# EAGLE design buttons (EAGLE 5.10)
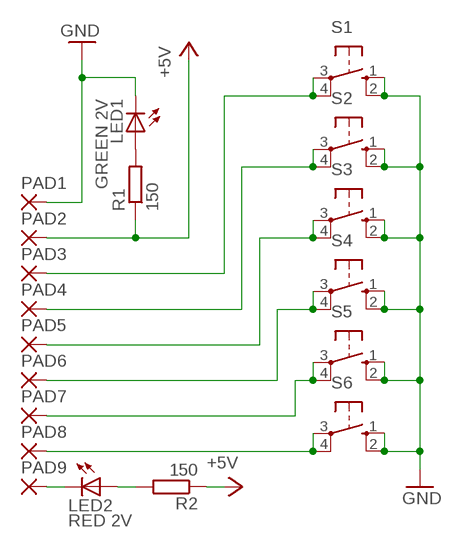
[diagram p0: schematic, sheet 1]

## Parts
LED1  GREEN 2V  LED5MM  [LED5MM]
LED2  RED 2V  LED5MM  [LED5MM]
PAD1  2,54/0,8  [2,54/0,8]
PAD2  2,54/0,8  [2,54/0,8]
PAD3  2,54/0,8  [2,54/0,8]
PAD4  2,54/0,8  [2,54/0,8]
PAD5  2,54/0,8  [2,54/0,8]
PAD6  2,54/0,8  [2,54/0,8]
PAD7  2,54/0,8  [2,54/0,8]
PAD8  2,54/0,8  [2,54/0,8]
PAD9  2,54/0,8  [2,54/0,8]
R1  150  R-EU_0204/7  [0204/7]
R2  150  R-EU_0204/7  [0204/7]
S1  10-XX  [B3F-10XX]
S2  10-XX  [B3F-10XX]
S3  10-XX  [B3F-10XX]
S4  10-XX  [B3F-10XX]
S5  10-XX  [B3F-10XX]
S6  10-XX  [B3F-10XX]

## Nets
+5V: PAD2.1(P) R1.1 R2.1
GND: LED1.K(C) PAD1.1(P) S1.1(S) S1.2(S1) S2.1(S) S2.2(S1) S3.1(S) S3.2(S1) S4.1(S) S4.2(S1) S5.1(S) S5.2(S1) S6.1(S) S6.2(S1)
N$1: LED1.A R1.2
N$2: LED2.K(C) PAD9.1(P)
N$3: LED2.A R2.2
N$4: PAD8.1(P) S6.3(P) S6.4(P1)
N$5: PAD7.1(P) S5.3(P) S5.4(P1)
N$6: PAD6.1(P) S4.3(P) S4.4(P1)
N$7: PAD5.1(P) S3.3(P) S3.4(P1)
N$8: PAD4.1(P) S2.3(P) S2.4(P1)
N$9: PAD3.1(P) S1.3(P) S1.4(P1)

## Library data of the parts
LED1 LED2 = led:LED: LED OSRAM: - CHIPLED LG R971, LG N971, LY N971, LG Q971, LY Q971, LO R971, LY R971 LH N974, LH R974 LS Q976, LO Q976, LY Q976 LO Q996 - Hyper CHIPLED LW Q18S LB Q993, LB Q99A, LB R99A - SideLED LS A670, LO A670, LY A670, LG A670, LP A670 LB A673, LV A673, LT A673, LW A673 LH A674 LY A675 LS A676, LA A676, LO A676, LY A676, LW A676 LS A679, LY A679, LG A679 - Hyper Micro SIDELED® LS Y876, LA Y876, LO Y876, LY Y876 LT Y87S - SmartLED LW L88C, LW L88S LB L89C, LB L89S, LG L890 LS L89K, LO L89K, LY L89K LS L896, LA L896, LO L896, LY L896 - TOPLED LS T670, LO T670, LY T670, LG T670, LP T670 LSG T670, LSP T670, LSY T670, LOP T670, LYG T670 LG T671, LOG T671, LSG T671 LB T673, LV T673, LT T673, LW T673 LH T674 LS T676, LA T676, LO T676, LY T676, LB T676, LH T676, LSB T676, LW T676 LB T67C, LV T67C, LT T67C, LS T67K, LO T67K, LY T67K, LW E67C LS E67B, LA E67B, LO E67B, LY E67B, LB E67C, LV E67C, LT E67C LW T67C LS T679, LY T679, LG T679 LS T770, LO T770, LY T770, LG T770, LP T770 LB T773, LV T773, LT T773, LW T773 LH T774 LS E675, LA E675, LY E675, LS T675 LS T776, LA T776, LO T776, LY T776, LB T776 LHGB T686 LT T68C, LB T68C - Hyper Mini TOPLED® LB M676 - Mini TOPLED Santana® LG M470 LS M47K, LO M47K, LY M47K Source: http://www.osram.convergy.de LUXEON: - LUMILED® LXK2-PW12-R00, LXK2-PW12-S00, LXK2-PW14-U00, LXK2-PW14-V00 LXK2-PM12-R00, LXK2-PM12-S00, LXK2-PM14-U00 LXK2-PE12-Q00, LXK2-PE12-R00, LXK2-PE12-S00, LXK2-PE14-T00, LXK2-PE14-U00 LXK2-PB12-K00, LXK2-PB12-L00, LXK2-PB12-M00, LXK2-PB14-N00, LXK2-PB14-P00, LXK2-PB14-Q00 LXK2-PR12-L00, LXK2-PR12-M00, LXK2-PR14-Q00, LXK2-PR14-R00 LXK2-PD12-Q00, LXK2-PD12-R00, LXK2-PD12-S00 LXK2-PH12-R00, LXK2-PH12-S00 LXK2-PL12-P00, LXK2-PL12-Q00, LXK2-PL12-R00 Source: www.luxeon.com KINGBRIGHT: KA-3528ASYC Source: www.kingbright.com
PAD1-PAD9 = wirepad:2,54/0,8: THROUGH-HOLE PAD
R1 R2 = rcl:R-EU_: RESISTOR, European symbol
S1-S6 = switch-omron:10-XX: OMRON SWITCH

## Board
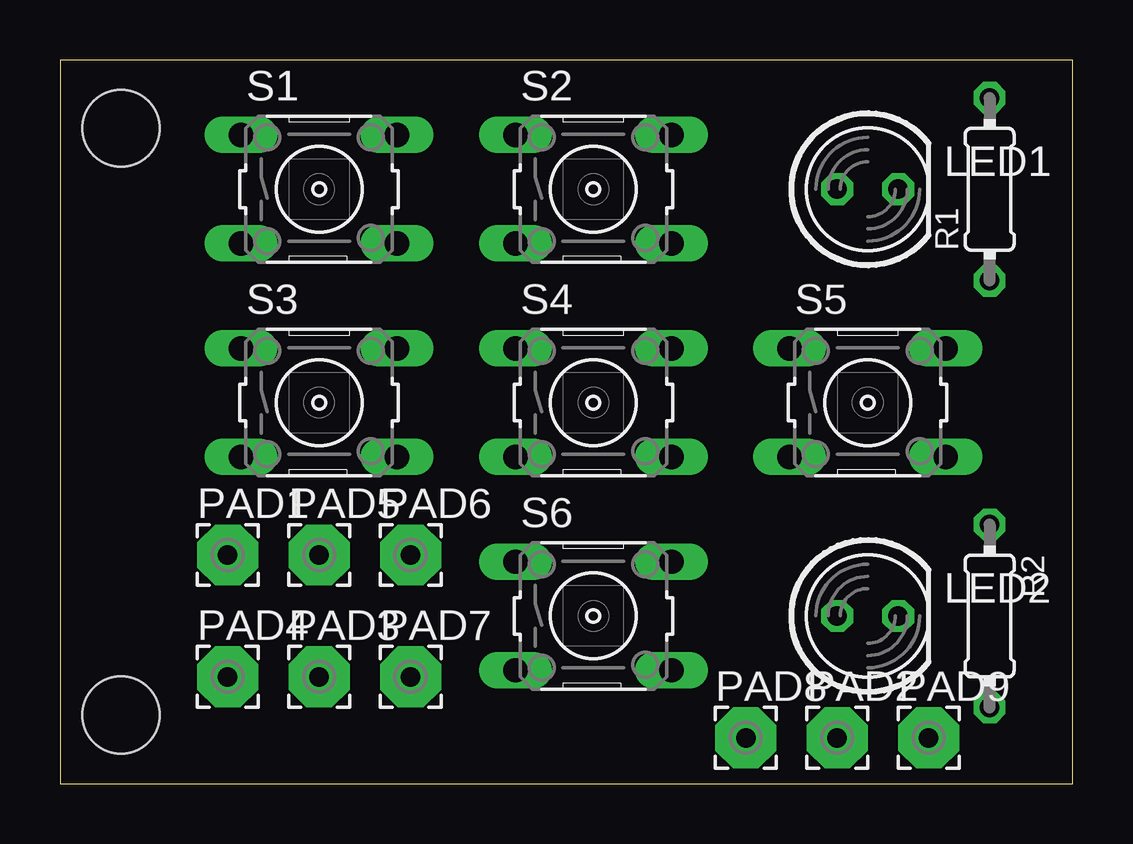
[diagram p1: board, top side]
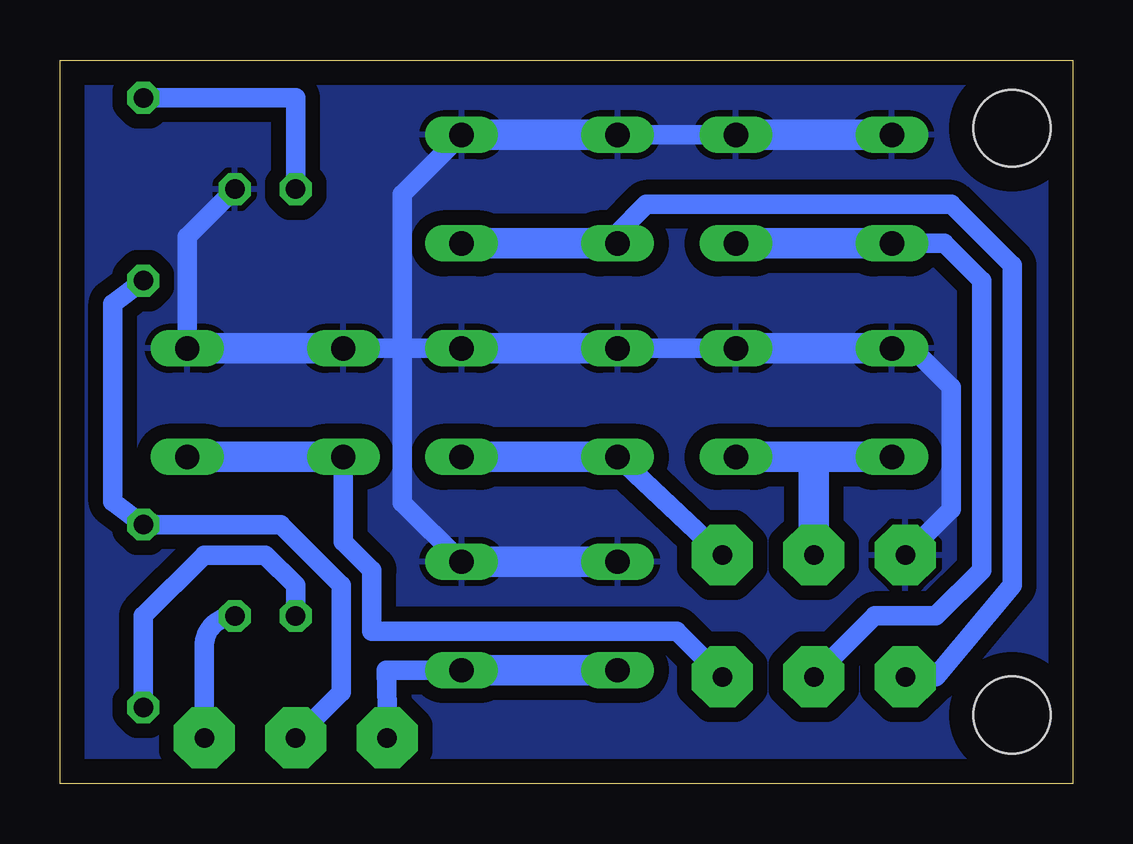
[diagram p2: board, bottom side, seen from below]

Size 42.21 x 30.15 mm. Coordinates in mm from the lower left corner, seen from the top.
Outline: 0,0 42.21,0 42.21,30.15 0,30.15 0,0
Copper layers (1*16): Top 0.035mm / dielectric 1.5mm / Bottom 0.035mm
Design rules "default": minimum track width 10mil, minimum drill 24mil, track to track 8mil, track to pad 8mil, pad to pad 8mil, via to via 8mil, smd to smd 8mil, copper to edge 40mil, drill to drill 8mil, minimum pad ring 10mil, minimum via ring 8mil, stop-mask expansion 4mil, vias tented up to drill 0mil, thermal gap 10mil
Holes 3.2 mm at 2.54,27.3 2.54,2.86

### Footprints (pad centres in the part's own frame; a part is rotated, then mirrored left to right if it is on the bottom)
LED5MM = drill 0.813 octagon: A -1.27,0; K 1.27,0
2,54/0,8 = drill 0.813 pad 2.54 octagon: 1 0,0
0204/7 = drill 0.813 octagon: 1 -3.81,0; 2 3.81,0
B3F-10XX = drill 1.016 long: 1 -3.251,2.261; 2 3.251,2.261; 3 -3.251,-2.261; 4 3.251,-2.261

### Placement (x,y rotation side)
LED1  33.66,24.77 0 top
LED2  33.66,6.99 0 top
PAD1  6.99,9.53 0 top
PAD2  32.38,1.91 0 top
PAD3  10.79,4.45 0 top
PAD4  6.99,4.45 0 top
PAD5  10.79,9.53 0 top
PAD6  14.61,9.53 0 top
PAD7  14.61,4.45 0 top
PAD8  28.57,1.91 0 top
PAD9  36.2,1.91 0 top
R1  38.73,24.77 90 top
R2  38.73,6.99 270 top
S1  10.79,24.77 0 top
S2  22.23,24.77 0 top
S3  10.79,15.88 0 top
S4  22.23,15.88 0 top
S5  33.66,15.88 0 top
S6  22.23,6.99 0 top

### Tracks (layer width: path | path; a pad name or v marks a point on that pad's centre or on a via)
+5V
  Bottom 0.813: R1.1 40.01,20 40.01,11.75 R2.1 33.02,10.79 30.48,8.26 30.48,3.81 PAD2.1
GND
  Bottom 0.813: S5.2 36.91,22.78 LED1.K | PAD1.1 5.08,11.43 5.08,16.51 6.71,18.14 | S2.1 S1.2 | S3.2 S4.1 | S4.2 27.94,18.14 | 27.94,18.14 S5.1 | S6.2 27.94,11.71 27.94,18.14 | S2.2 27.94,24.56 27.94,18.14
  Bottom 1.27: S5.1 S5.2 | S6.2 S6.1 | S4.1 S4.2 | S3.2 S3.1 6.71,18.14 | S1.2 S1.1 | S2.2 S2.1
  pour Bottom (isolate 0.61): 0,29.84 0,0 42.23,0.32 42.23,30.16
N$1
  Bottom 0.813: LED1.A 32.38,28.57 R1.2
N$2
  Bottom 0.813: PAD9.1 36.2,5.71 arc90 LED2.K
N$3
  Bottom 0.813: LED2.A 32.38,8.26 33.66,9.53 36.2,9.53 38.73,6.99 R2.2
N$4
  Bottom 0.813: PAD8.1 28.57,3.17 28.61,4.72 S6.4
  Bottom 1.27: S6.3 S6.4
N$5
  Bottom 0.813: PAD7.1 16.51,6.35 29.21,6.35 29.21,8.89 30.4,10.08 S5.3
  Bottom 1.27: S5.3 S5.4
N$6
  Bottom 0.813: PAD6.1 S4.3
  Bottom 1.27: S4.3 S4.4
N$7
  Bottom 1.27: 10.79,13.61 S3.3 | 10.79,13.61 S3.4 | PAD5.1 10.79,13.61
N$8
  Bottom 0.813: PAD4.1 5.71,4.45 2.54,8.26 2.54,21.59 5.08,24.13 17.78,24.13 18.97,22.94 S2.3
  Bottom 1.27: S2.3 S2.4
N$9
  Bottom 0.813: PAD3.1 8.26,6.99 5.71,6.99 3.81,8.89 3.81,20.95 5.36,22.5 S1.3
  Bottom 1.27: S1.3 S1.4